# Altium schematic sheet FPGA.SchDoc: FPGA TOP
size A4; DocumentNumber: 6; SheetNumber: 6; SheetTotal: 18
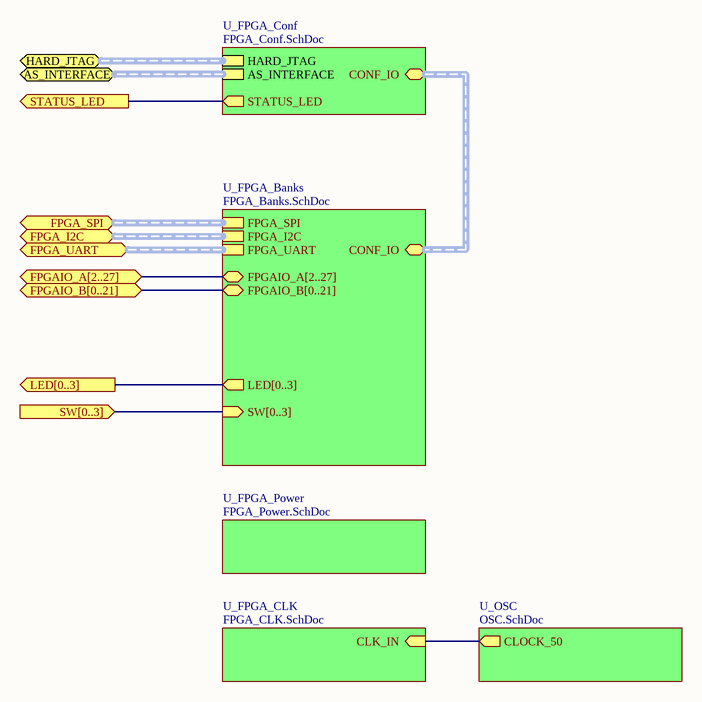
[diagram p0: FPGA.SchDoc]

## Sub-sheets
U_FPGA_Banks = FPGA_Banks.SchDoc: FPGA_SPI (harness FPGA_SPI), FPGA_I2C (harness I2C), FPGAIO_A[2..27] (bidir), FPGAIO_B[0..21] (bidir, harness TEST_INT), FPGA_UART (harness FPGA_UART), CONF_IO (harness CONF_IO), SW[0..3] (in), LED[0..3] (out)
U_FPGA_CLK = FPGA_CLK.SchDoc: CLK_IN (in)
U_FPGA_Conf = FPGA_Conf.SchDoc: HARD_JTAG (harness HARD_JTAG), AS_INTERFACE (harness AS_INTERFACE), STATUS_LED (out), CONF_IO (harness CONF_IO)
U_FPGA_Power = FPGA_Power.SchDoc: no entries
U_OSC = OSC.SchDoc: CLOCK_50 (out)

## Ports
AS_INTERFACE (harness AS_INTERFACE), FPGA_I2C (harness I2C), FPGA_SPI (harness FPGA_SPI), FPGA_UART (harness FPGA_UART), FPGAIO_A[2..27] (bidir), FPGAIO_B[0..21] (bidir, harness TEST_INT), HARD_JTAG (harness HARD_JTAG), LED[0..3] (out), STATUS_LED (out), SW[0..3] (in)

## Nets
STATUS_LED: port STATUS_LED, sheet U_FPGA_Conf/STATUS_LED
(unnamed): sheet U_FPGA_CLK/CLK_IN, sheet U_OSC/CLOCK_50

## Buses and harness runs
bus port FPGAIO_A[2..27] = sheet U_FPGA_Banks/FPGAIO_A[2..27]
bus port LED[0..3] = sheet U_FPGA_Banks/LED[0..3]
bus port SW[0..3] = sheet U_FPGA_Banks/SW[0..3]
harness port AS_INTERFACE = sheet U_FPGA_Conf/AS_INTERFACE
harness port FPGA_I2C = sheet U_FPGA_Banks/FPGA_I2C
harness port FPGA_SPI = sheet U_FPGA_Banks/FPGA_SPI
harness port FPGA_UART = sheet U_FPGA_Banks/FPGA_UART
harness port HARD_JTAG = sheet U_FPGA_Conf/HARD_JTAG
harness sheet U_FPGA_Banks/CONF_IO = sheet U_FPGA_Conf/CONF_IO

## Notes on the sheet
- Title
- Size:
- Date:
- A4
- Number:
- Time:
- Revision:
- Sheet
- of
- File: